# EasyEDA Pro project DAPLink.eprj

# Schematic DAPLink
Board Name: DAPLink; Create Date: 2022-11-13; Page Name: Core; Project Name: DAPLink; Schematic Name: DAPLink; Update Date: 2025-05-07; Company: 嘉立创EDA; Page Size: A4; Version: V1.0
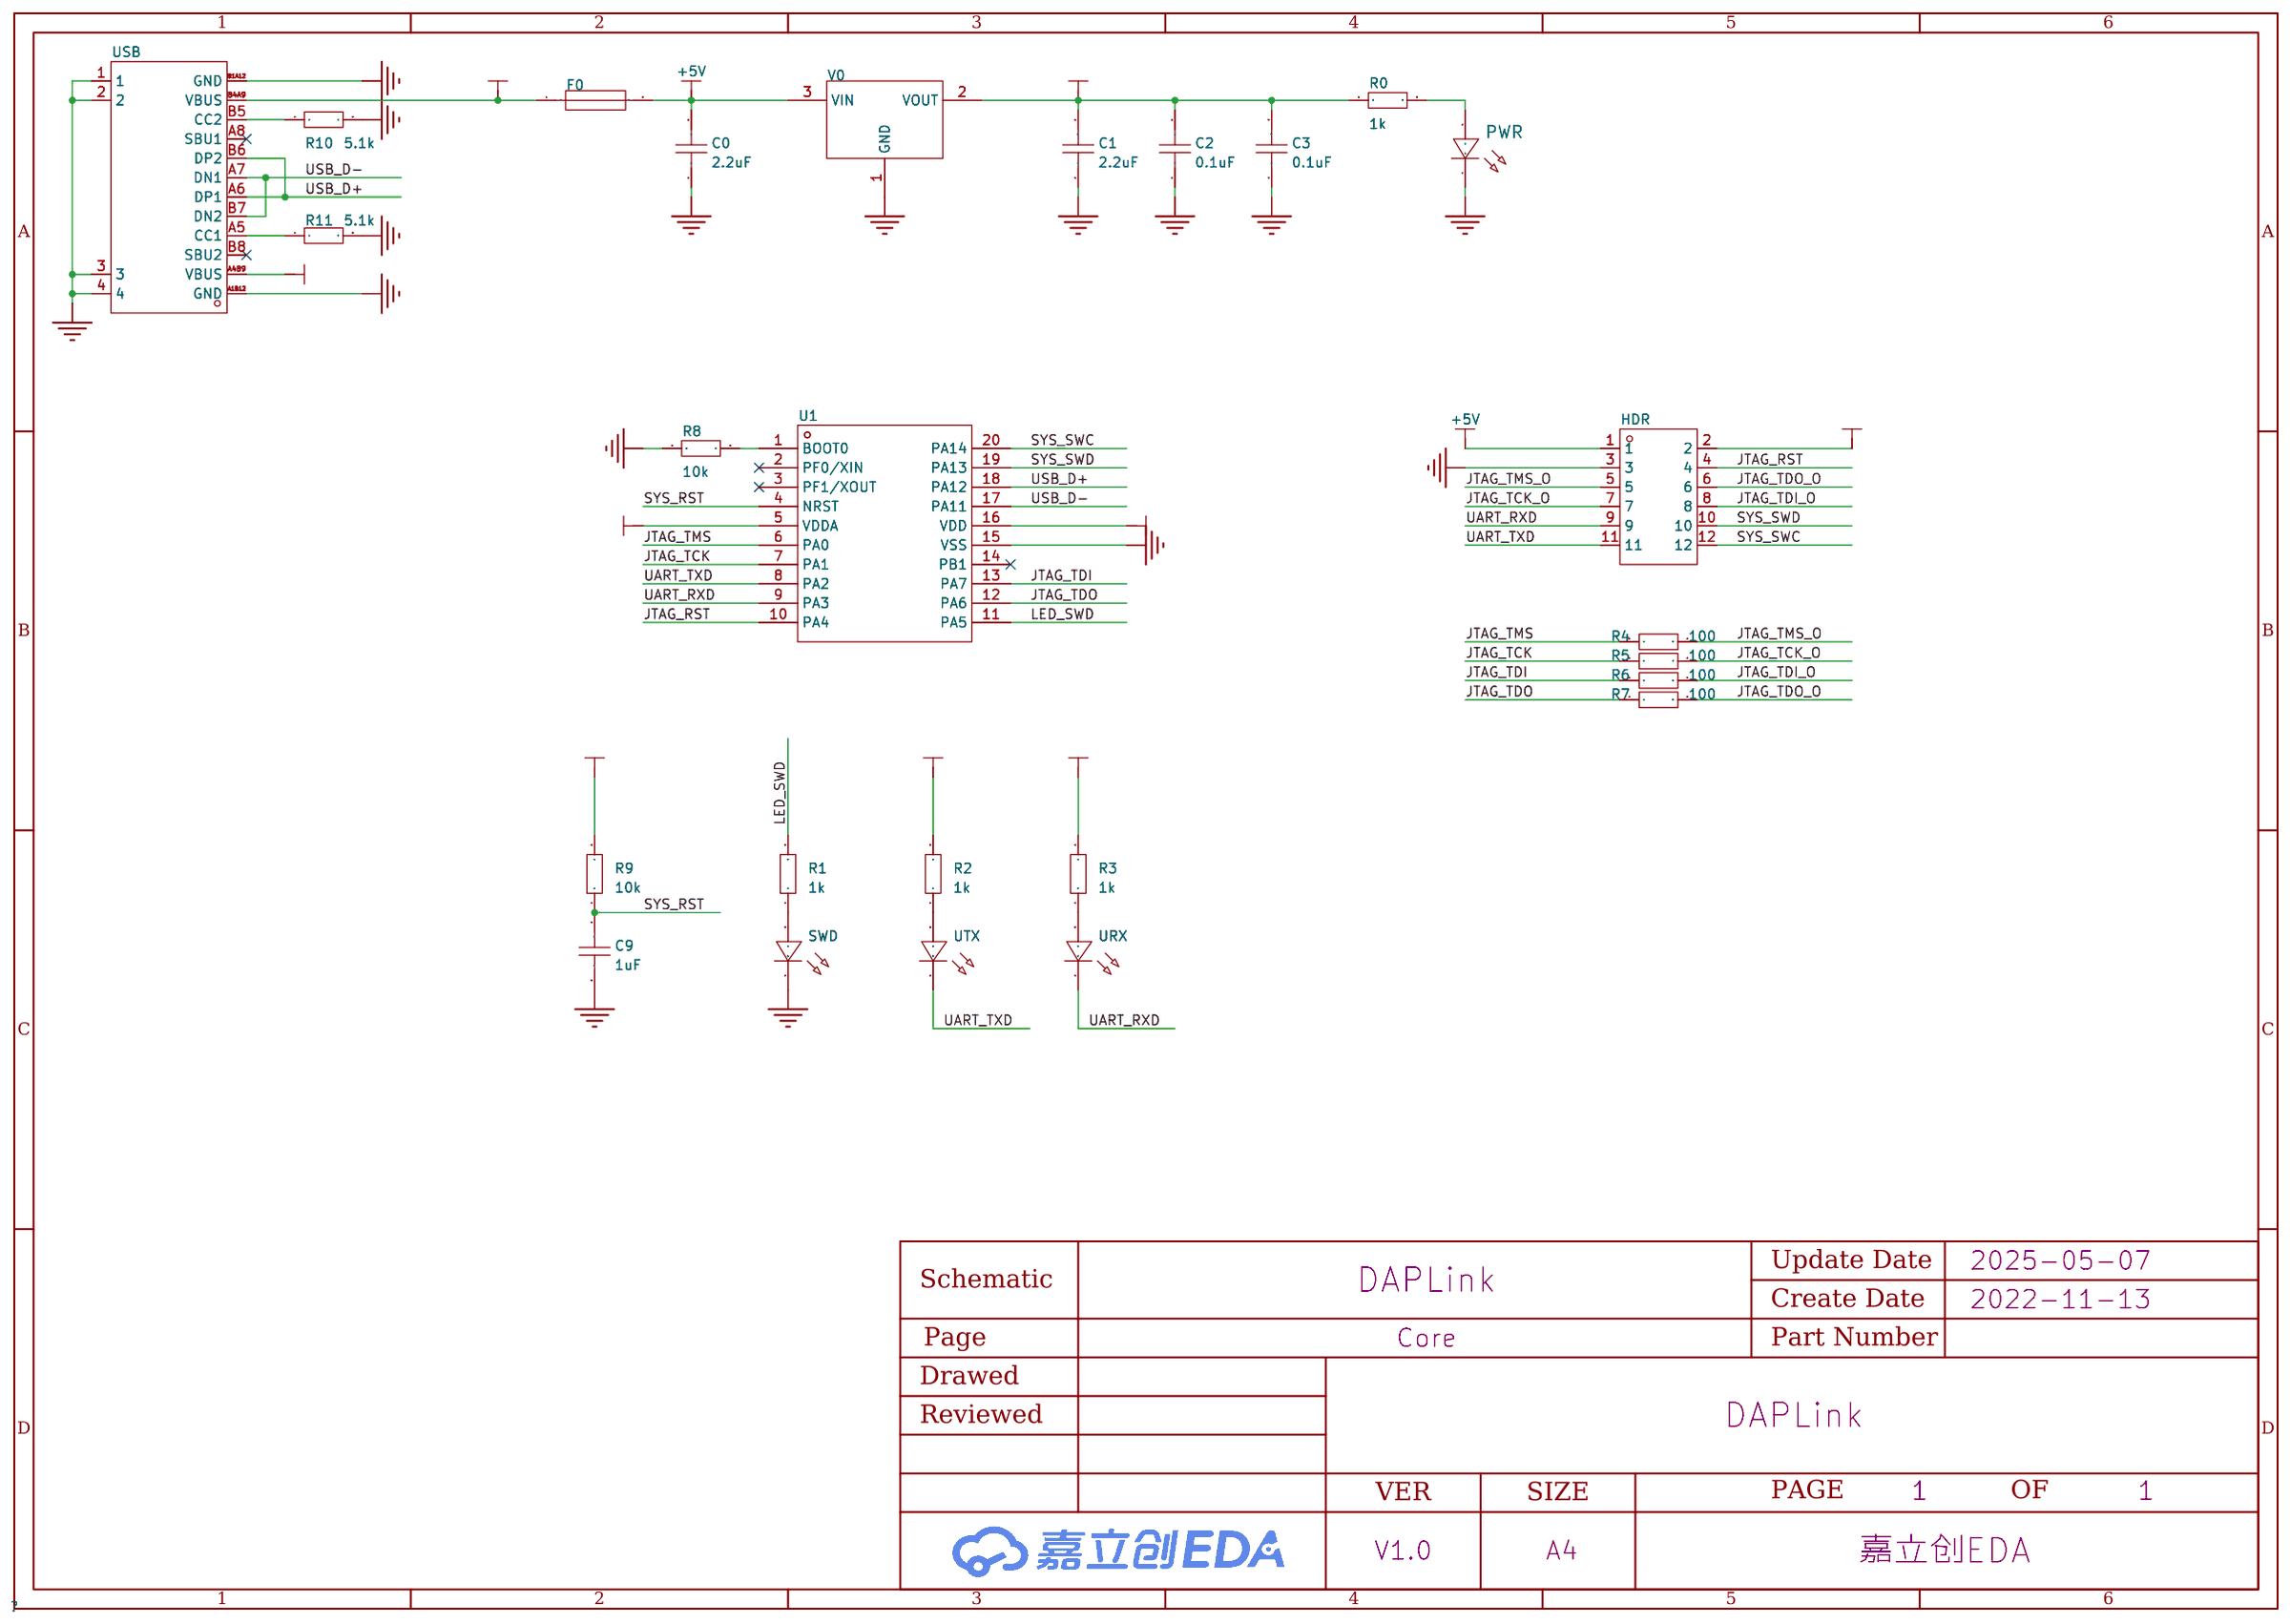
[diagram p0: schematic sheet]

## Parts
C0  2.2uF  [C0603]
C1  2.2uF  [C0603]
C2  0.1uF  [C0603]
C3  0.1uF  [C0603]
C9  1uF  [C0603]
F0  JK-nSMD050-30  [F1206]
HDR  -  [HDR-SMD_2X6P-P2.54]
PWR  -  [LED_0603]
R0  1k  [R0603]
R1  1k  [R0603]
R2  1k  [R0603]
R3  1k  [R0603]
R4  100  [R0603]
R5  100  [R0603]
R6  100  [R0603]
R7  100  [R0603]
R8  10k  [R0603]
R9  10k  [R0603]
R10  5.1k  [R0603]
R11  5.1k  [R0603]
SWD  -  [LED_0603]
U1  -  [TSSOP-20_L6.5-W4.4-P0.65-LS6.4-BL]
URX  -  [LED_0603]
USB  USB-TYPE-C-017  [USB-TYPE-C-SMD_C9900008089]
UTX  -  [LED_0603]
V0  HT7233  [SOT-23-3_L2.9-W1.6-P1.90-LS2.8-BR]

## Library data of the parts
C0-C3 C9 = CAP_0603: 容值:100nF;精度:±10%;额定电压:50V;温度系数:X7R;; Supplier Footprint: 0603
F0 = JK-nSMD050-30: LCSC Part Name: 30V 500mA 1206自恢复; Supplier Part: C720075; Manufacturer: JK(金科); Supplier Footprint: 1206; JLCPCB Part Class: 扩展库; Datasheet: https://atta.szlcsc.com/upload/public/pdf/source/20200810/C720075_06AF2D4541537091880CC35F0EFB49F8.pdf; Supplier: LCSC; Voltage - Max: 30V; Current - Max: 100A; Hold Current: 500mA; Trip Current: 1A; Power Dissipation: 600mW; Resistance - Initial (Ri) (Min): 150mΩ; Resistance - Post Trip (R1) (Max): 300mΩ; Time to Trip(Max): 100ms
HDR = HDR-M_2.54_2x6: Supplier Part: C30734; Supplier Footprint: 插件,P=2.54mm
PWR = LED_0603-R: Supplier Footprint: 0603
R0-R11 = Res_0603: Supplier Footprint: 0603
SWD = LED_0603-B: Supplier Footprint: 0603
U1 = AT32F425F8
URX UTX = LED_0603-G: Supplier Footprint: 0603
USB = USB-TYPE-C-017: 连接器类型:Type-C;标准:-;公母:母座;触点数量:16;端口数量:1;安装方式:卧贴;额定电流 - 电源:3A;工作温度范围:-25~+85;; Supplier Part: C2927037; Manufacturer: DEALON(德艺隆); Supplier Footprint: SMD; JLCPCB Part Class: 扩展库; Datasheet: https://atta.szlcsc.com/upload/public/pdf/source/20211217/653222EE5174722C9DFE2966329956D8.pdf; Supplier: LCSC; Connector Type: Type-C; Gender: 母座; Number of Contacts: 16; Number of Ports: 1; Mounting Style: 卧贴; Current Rating - Power (Max): 3A; Operating Temperature Range: -25~+85
V0 = HT7233: 输出类型:固定;输出极性:正;输出通道数:1;最大输入电压:8V;输出电压:3.3V;压差:300mV@(300mA);静态电流(地电流):-;输出电流:300mA;电源纹波抑制比(PRSS):-;; LCSC Part Name: Vin=8V Vout=3.3V 300mA; Supplier Part: C47970; Manufacturer: HOLTEK(台湾合泰/盛群); Supplier Footprint: SOT-23(SOT-23-3); JLCPCB Part Class: 扩展库; Datasheet: https://atta.szlcsc.com/upload/public/pdf/source/20150618/1457707321217.pdf; Supplier: LCSC; Output Type: 固定; Output Polarity: 正; Number of Outputs: 1; Maximum Input Voltage: 8V; Output Voltage: 3.3V; Dropout Voltage: 300mV@(300mA); Output Current: 300mA

## Nets
+3.3V: C1.2 C2.2 C3.2 HDR.2 R0.1 R2.2 R3.2 R9.2 U1.5(VDDA) U1.16(VDD) V0.2(VOUT)
+5V: C0.2 F0.2 HDR.1 V0.3(VIN)
GND: C0.1 C1.1 C2.1 C3.1 C9.2 HDR.3 PWR.1(C) R8.1 R10.2 R11.2 SWD.1(C) U1.15(VSS) USB.1 USB.2 USB.3 USB.4 USB.A1B12(GND) USB.B1A12(GND) V0.1(GND)
VBUS: F0.1 USB.A4B9(VBUS) USB.B4A9(VBUS)
JTAG_RST: HDR.4 U1.10(PA4)
JTAG_TCK: R5.1 U1.7(PA1)
JTAG_TCK_O: HDR.7 R5.2
JTAG_TDI: R6.1 U1.13(PA7)
JTAG_TDI_O: HDR.8 R6.2
JTAG_TDO: R7.1 U1.12(PA6)
JTAG_TDO_O: HDR.6 R7.2
JTAG_TMS: R4.1 U1.6(PA0)
JTAG_TMS_O: HDR.5 R4.2
LED_SWD: R1.2 U1.11(PA5)
SYS_RST: C9.1 R9.1 U1.4(NRST)
SYS_SWC: HDR.12 U1.20(PA14)
SYS_SWD: HDR.10 U1.19(PA13)
UART_RXD: HDR.9 U1.9(PA3) URX.1(C)
UART_TXD: HDR.11 U1.8(PA2) UTX.1(C)
USB_D+: U1.18(PA12) USB.A6(DP1) USB.B6(DP2)
USB_D-: U1.17(PA11) USB.A7(DN1) USB.B7(DN2)
$1N2511: R11.1 USB.A5(CC1)
$1N2512: R10.1 USB.B5(CC2)
$1N2528: PWR.2(A) R0.2
$1N4668: R8.2 U1.1(BOOT0)
$1N8351: R1.1 SWD.2(A)
$1N9627: R2.1 UTX.2(A)
$1N9652: R3.1 URX.2(A)

Not connected (* = marked no-connect by the designer): U1 2(PF0/XIN)* 3(PF1/XOUT)* 14(PB1)*; USB A8(SBU1)* B8(SBU2)*

# Board DAPLink
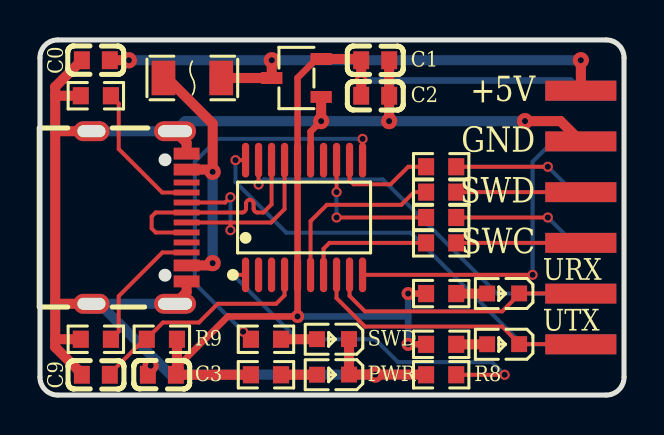
[diagram p1: board, top side]
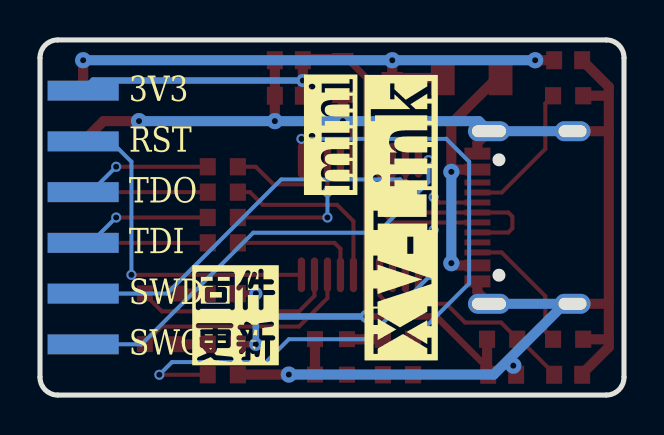
[diagram p2: board, bottom side, seen from below]

Outline 29.21 x 17.78 mm; copper layers: Top Layer, Bottom Layer. Coordinates in mm from the lower left corner of the outline.
Outline path: 0,16.89 0,0.89 arc(0.26,0.26) 0.89,0 28.32,0 arc(28.95,0.26) 29.21,0.89 29.21,16.89 arc(28.95,17.52) 28.32,17.78 0.89,17.78 arc(0.26,17.52) 0,16.89
Stack: Top Layer 0.035mm / Dielectric1 1.51mm FR4 er 4.5 / Bottom Layer 0.035mm

## Design rules (mm)
spacing safeClearance (default): track to track 0.152, other pairs 0.152 to 0.3
track width trackWidth (default): min 0.127, default 0.254, max 2.54
differential pair differentialPair (default): width min 0.127, default 0.254, max 2.54; gap min 0.152, default 0.152
via viaSize (default): diameter min 0.5, default 0.61, max 10; hole min 0.3, default 0.305, max 6

## Placement (name value [footprint] x y rotation side)
C0  2.2uF  [C0603]  2.79 16.76 0 top
C1  2.2uF  [C0603]  16.76 16.76 180 top
C2  0.1uF  [C0603]  16.76 14.99 180 top
C3  0.1uF  [C0603]  6.1 1.02 0 top
C9  1uF  [C0603]  2.79 1.02 180 top
F0  JK-nSMD050-30  [F1206]  7.62 15.88 0 top
HDR  -  [HDR-SMD_2X6P-P2.54]  27.05 15.24 0 top
PWR  -  [LED_0603]  14.6 1.02 180 top
R0  1k  [R0603]  11.3 1.02 0 top
R1  1k  [R0603]  11.3 2.79 180 top
R2  1k  [R0603]  20.07 2.54 180 top
R3  1k  [R0603]  20.07 5.08 180 top
R4  100  [R0603]  20.07 10.16 0 top
R5  100  [R0603]  20.07 7.62 0 top
R6  100  [R0603]  20.07 8.89 0 top
R7  100  [R0603]  20.07 11.43 0 top
R8  10k  [R0603]  20.07 1.02 0 top
R9  10k  [R0603]  6.1 2.79 0 top
R10  5.1k  [R0603]  2.79 2.79 180 top
R11  5.1k  [R0603]  2.79 14.99 180 top
SWD  -  [LED_0603]  14.6 2.79 180 top
U1  -  [TSSOP-20_L6.5-W4.4-P0.65-LS6.4-BL]  13.21 8.89 0 top
URX  -  [LED_0603]  23.11 5.08 180 top
USB  USB-TYPE-C-017  [USB-TYPE-C-SMD_C9900008089]  4.95 8.89 270 top
UTX  -  [LED_0603]  23.11 2.54 180 top
V0  HT7233  [SOT-23-3_L2.9-W1.6-P1.90-LS2.8-BR]  12.83 15.88 0 top

## Footprints (pads in the part's own frame, mm; a bottom-side part is the same pattern mirrored in y, then rotated)
C0603
  rect 0.8x0.9 smd: 1(-0.7,0) 2(0.7,0)
F1206
  rect 1.19x1.728 smd: 1(-1.445,0) 2(1.445,0)
HDR-SMD_2X6P-P2.54
  rect 3.556x1 smd: 1(0,0) 3(0,-2.54) 5(0,-5.08) 7(0,-7.62) 9(0,-10.16) 11(0,-12.7)
  rect 3.556x1 smd far side: 2(0,0) 4(0,-2.54) 6(0,-5.08) 8(0,-7.62) 10(0,-10.16) 12(0,-12.7)
LED_0603
  rect 0.8x0.8 smd: 1(-0.851,-0.01) 2(0.75,-0.005)
R0603
  rect 0.806x0.864 smd: 1(-0.753,0) 2(0.753,0)
SOT-23-3_L2.9-W1.6-P1.90-LS2.8-BR
  rect 1.07x0.6 smd: 1(1.235,-0.95) 2(1.235,0.95) 3(-1.235,0)
TSSOP-20_L6.5-W4.4-P0.65-LS6.4-BL
  oval 0.364x1.742 smd: 1(-2.925,-2.871) 2(-2.275,-2.871) 3(-1.625,-2.871) 4(-0.975,-2.871) 5(-0.325,-2.871) 6(0.325,-2.871) 7(0.975,-2.871) 8(1.625,-2.871) 9(2.275,-2.871) 10(2.925,-2.871) 11(2.925,2.871) 12(2.275,2.871) 13(1.625,2.871) 14(0.975,2.871) 15(0.325,2.871) 16(-0.325,2.871) 17(-0.975,2.871) 18(-1.625,2.871) 19(-2.275,2.871) 20(-2.925,2.871)
USB-TYPE-C-SMD_C9900008089
  oval 1x2.1 hole 0.6x1.7: 1(-4.32,1.801) 2(4.32,1.801)
  oval 1x1.8 hole 0.6x1.4: 3(-4.32,-2.379) 4(4.32,-2.379)
  rect 0.6x1.3 smd: A1B12(-3.2,2.379) A4B9(-2.4,2.379) B1A12(3.2,2.379) B4A9(2.4,2.379)
  rect 0.3x1.3 smd: A5(-1.25,2.379) A6(-0.25,2.379) A7(0.25,2.379) A8(1.25,2.379) B5(1.75,2.379) B6(0.75,2.379) B7(-0.75,2.379) B8(-1.75,2.379)

## Nets
As in the schematic.

Pads without a net: U1 2 3 14; USB A8 B8

## Via types
v1: diameter 0.813, hole 0.305, Top Layer to Bottom Layer, 10 vias
v2: diameter 0.508, hole 0.305, Top Layer to Bottom Layer, 13 vias
v3: diameter 0.66, hole 0.305, Top Layer to Bottom Layer, 4 vias

## Routing (per net, layer and track width the routed paths; a pad name or vN(x,y) marks a point on that pad's centre or on a via; arc(x,y) is an arc through that point)
+3.3V: length 51
  Top Layer w0.33: V0.2 13.83,16.83 12.88,15.88 U1.16 U1.5 v3(12.88,3.94) 9.4,3.94 6.85,1.39 ; R3.2 v3(18.41,5.08) ; v3(18.41,2.54) R2.2
  Top Layer w0.508: R9.2 6.85,1.07 C3.2 R0.1 ; C2.2 C1.2 16,16.83 V0.2
  Bottom Layer w0.33: v3(18.41,5.08) 18.41,3.94 ; 18.41,3.94 v3(12.88,3.94) ; 18.41,3.94 v3(18.41,2.54) ; v3(16.06,15.75) 26.54,15.75 HDR.2
+5V: length 28.5
  Top Layer w0.508: F0.2 V0.3 v1(11.59,16.76) ; v1(27.05,16.76) HDR.1 ; C0.2 v1(4.44,16.76)
  Bottom Layer w0.508: v1(4.44,16.76) v1(11.59,16.76) v1(27.05,16.76)
GND: length 82.4
  Top Layer w0.33: U1.15 13.53,13.19 v1(14.06,13.72)
  Top Layer w0.508: SWD.1 PWR.1 v1(16.76,1.03) 19.3,1.03 R8.1 ; USB.2 7.33,5.15 USB.B1A12 ; USB.A1B12 7.33,12.63 USB.1 ; 0.76,13.21 0.76,4.57 ; 0.76,13.21 0.76,14.99 ; 0.76,13.21 USB.3 ; 0.76,4.57 0.76,2.79 ; 0.76,4.57 USB.4 ; C9.2 2.09,1.07 0.76,2.4 0.76,2.79 ; C1.1 C2.1 v1(17.46,13.72) ; HDR.3 26.03,13.72 v1(24.26,13.72) ; 0.76,14.99 R11.2 ; 0.76,14.99 0.76,15.43 C0.1 ; V0.1 v1(14.06,13.72) ; 0.76,2.79 R10.2
  Bottom Layer w0.508: 2.97,4.57 USB.2 ; 2.97,4.57 6.52,1.03 v1(16.76,1.03) ; 2.97,4.57 USB.4 ; USB.3 USB.1 7.26,13.72 v1(14.06,13.72) v1(17.46,13.72) v1(24.26,13.72)
  vias: v1(5.54,1.47)
VBUS: length 13.1
  Top Layer w0.508: F0.1 6.35,15.88 8.64,13.59 v1(8.64,11.18) 8.52,11.29 USB.A4B9 ; v1(8.64,6.6) 8.52,6.49 USB.B4A9
  Bottom Layer w0.508: v1(8.64,6.6) v1(8.64,11.18)
JTAG_RST: length 17
  Top Layer w0.203: U1.10 v2(24.64,6.02)
  Bottom Layer w0.203: HDR.4 25.65,12.7 24.64,11.68 v2(24.64,6.02)
JTAG_TCK: length 6.6
  Top Layer w0.203: U1.7 14.18,7.33 14.48,7.62 R5.1
JTAG_TCK_O: length 6.2
  Top Layer w0.203: R5.2 HDR.7
JTAG_TDI: length 7.4
  Top Layer w0.203: U1.13 v2(14.83,10.16) ; v2(14.83,8.89) R6.1
  Bottom Layer w0.203: v2(14.83,10.16) v2(14.83,8.89)
JTAG_TDI_O: length 6.8
  Top Layer w0.203: R6.2 v2(25.4,8.89)
  Bottom Layer w0.203: HDR.8 26.67,7.62 v2(25.4,8.89)
JTAG_TDO: length 5.3
  Top Layer w0.203: R7.1 18.41,11.43 17.54,10.55 15.69,10.55 15.48,10.75 U1.12
JTAG_TDO_O: length 6.8
  Top Layer w0.203: R7.2 v2(25.4,11.43)
  Bottom Layer w0.203: HDR.6 26.67,10.16 v2(25.4,11.43)
JTAG_TMS: length 9.1
  Top Layer w0.203: U1.6 13.53,8.71 14.35,9.53 18.07,9.53 18.71,10.16 R4.1
JTAG_TMS_O: length 6.2
  Top Layer w0.203: R4.2 HDR.5
LED_SWD: length 20
  Top Layer w0.203: R1.2 10.17,3.17 v2(10.16,3.17) ; U1.11 v2(16.13,12.83)
  Bottom Layer w0.203: v2(16.13,12.83) 8.89,12.83 7.75,11.68 7.75,5.59 v2(10.16,3.17)
SYS_RST: length 11.5
  Top Layer w0.203: C9.1 3.49,1.07 5.22,2.79 R9.1 5.34,2.82 6.15,3.63 7.95,3.63 8.89,4.57 11.81,4.57 12.23,4.99 U1.4
SYS_SWC: length 22.2
  Top Layer w0.203: U1.20 v2(9.78,11.76)
  Bottom Layer w0.203: HDR.12 24.13,2.54 18.54,8.13 12.32,8.13 9.78,10.67 v2(9.78,11.76)
SYS_SWD: length 19.8
  Top Layer w0.203: U1.19 v2(10.93,10.54)
  Bottom Layer w0.203: v2(10.93,10.54) 11.19,10.8 17.15,10.8 22.86,5.08 HDR.10
UART_RXD: length 13.3
  Top Layer w0.203: HDR.9 27.04,5.09 URX.1 23.97,5.04 23.11,4.19 16.26,4.19 15.48,4.96 U1.9
UART_TXD: length 14.4
  Top Layer w0.203: HDR.11 27.04,2.55 UTX.1 23.97,2.58 23.11,3.43 16.26,3.43 14.83,4.85 U1.8
USB_D+: length 11.8
  Top Layer w0.203: USB.B6 5.79,8.14 5.58,8.34 5.58,8.94 5.79,9.14 USB.A6 10.11,9.14 arc(10.25,9.2) 10.3,9.33 10.3,9.59 arc(10.49,9.78) 10.68,9.59 10.68,9.33 arc(10.74,9.2) 10.88,9.14 11.17,9.14 11.58,9.55 U1.18
USB_D-: length 12
  Top Layer w0.203: U1.17 12.23,9.31 11.56,8.64 9.53,8.64 ; v2(9.53,8.25) 9.53,8.64 ; 9.53,8.64 USB.A7 ; USB.B7 9.26,9.64 v2(9.53,9.91)
  Bottom Layer w0.203: v2(9.53,9.91) v2(9.53,8.25)
$1N2511: length 7.1
  Top Layer w0.203: R11.1 3.94,14.6 3.94,12.32 6.12,10.14 USB.A5
$1N2512: length 6.6
  Top Layer w0.203: R10.1 3.94,3.18 3.94,4.95 6.12,7.14 USB.B5
$1N2528: length 1.8
  Top Layer w0.508: PWR.2 13.85,1.02 R0.2
$1N4668: length 18.7
  Top Layer w0.203: U1.1 v2(9.65,6.02) ; R8.2 v2(23.24,1.02)
  Bottom Layer w0.203: v2(9.65,6.02) 12.88,2.79 16.76,2.79 17.91,1.65 22.61,1.65 v2(23.24,1.02)
$1N8351: length 1.8
  Top Layer w0.508: 13.86,2.8 13.85,2.79 R1.1
$1N9627: length 1.5
  Top Layer w0.508: UTX.2 22.36,2.54 R2.1
$1N9652: length 1.5
  Top Layer w0.508: R3.1 22.36,5.08 URX.2

## Text on the board
Bottom Silkscreen Layer: 3V3 | RST | TDO | TDI | SWD | SWC | 固件 / 更新 | mini | XV-Link
Top Silkscreen Layer: URX | UTX | +5V | GND | SWD | SWC
